# Altium schematic sheet Main.SchDoc: RFID Access Control System
size 294 x 281 mm; DrawnBy: Avishka C. Herath; Revision: 1.9; SheetNumber: 1; SheetTotal: 1; Index Number: 200212F
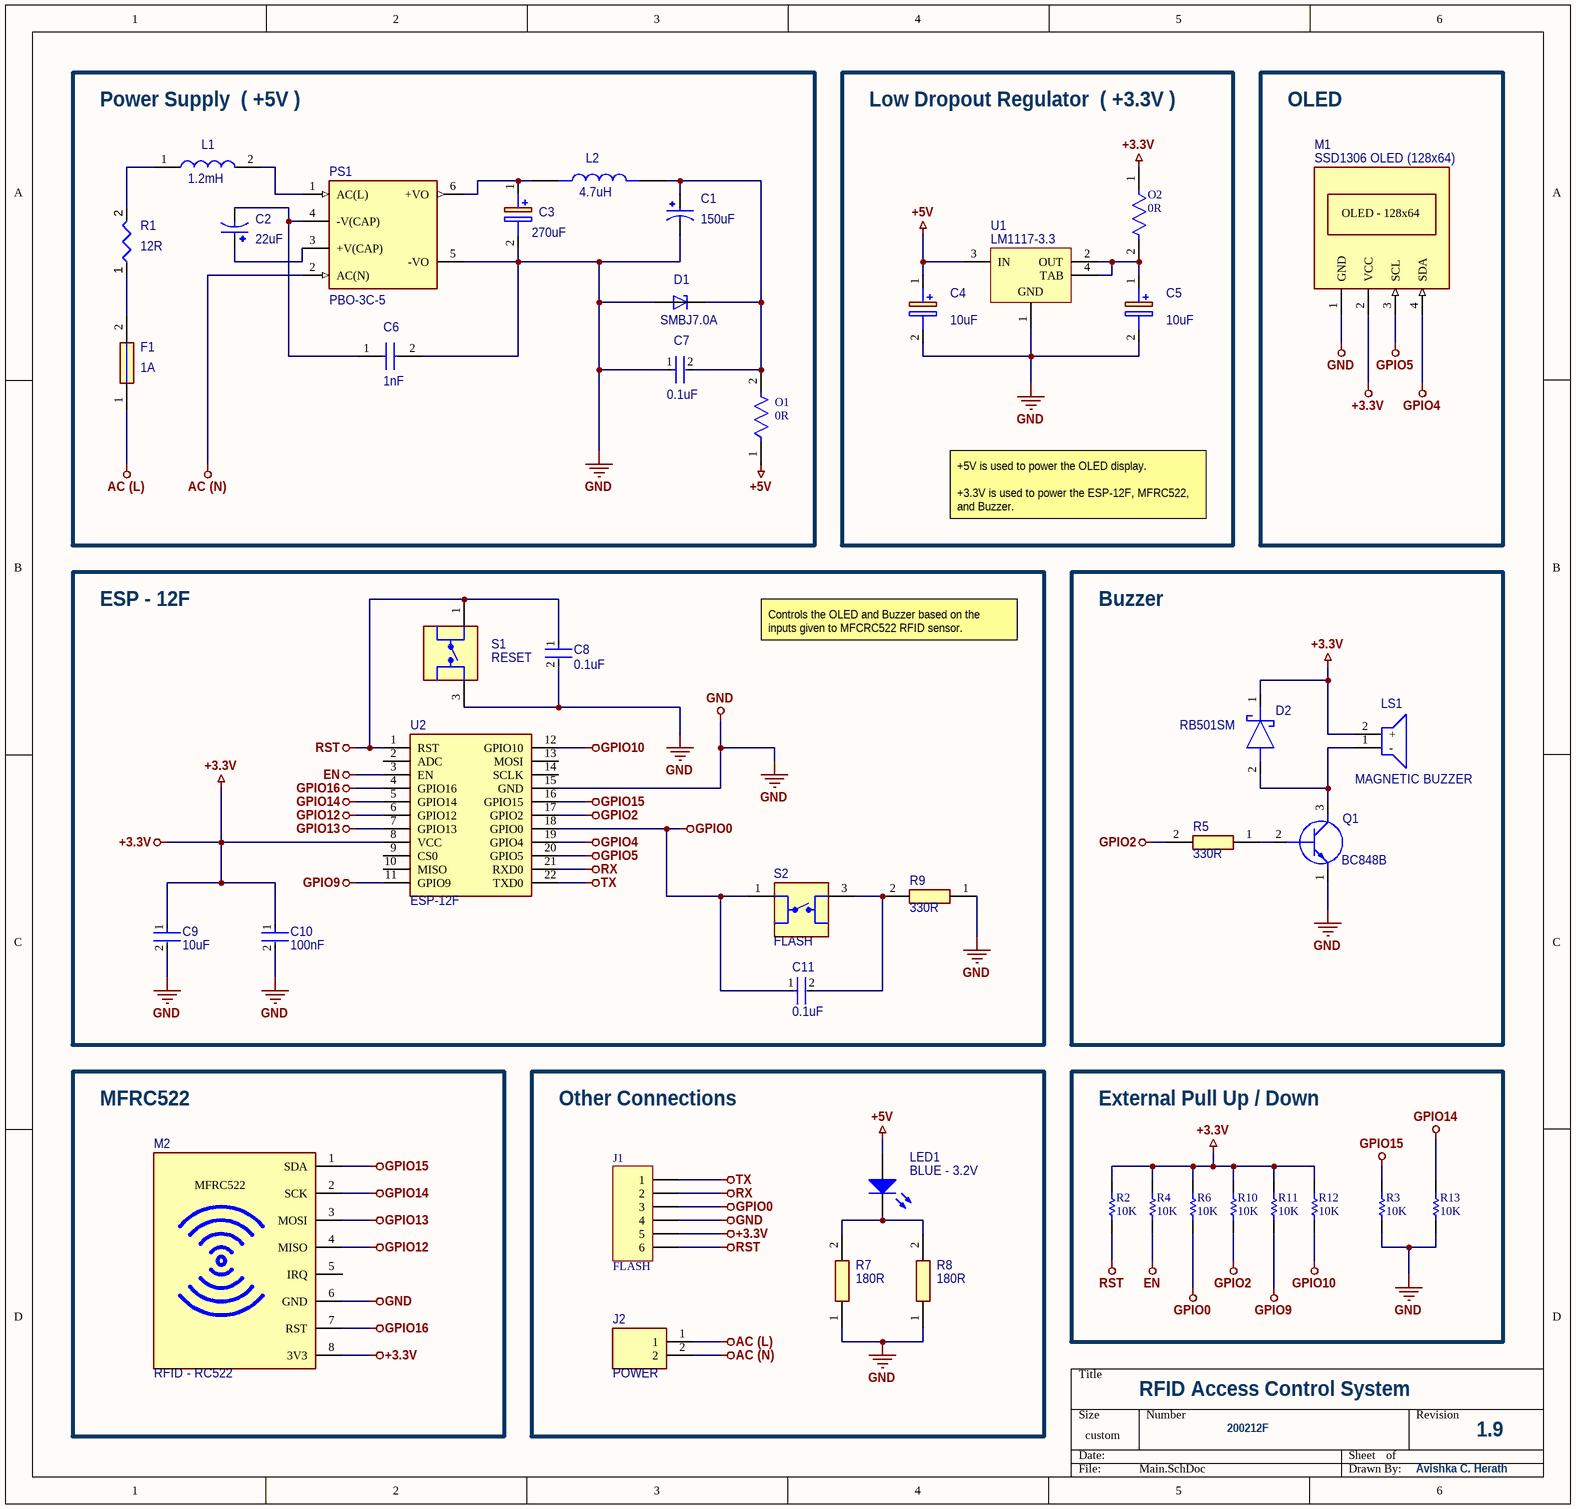
[diagram p0: Main.SchDoc]

## Parts
C1  150uF  [CAPPRD500W60D800H1150]
C2  22uF  [CAPPRD750W80D1600H2500]
C3  270uF  [CAPPRD250W65D630H900]
C4  10uF  [T491B]
C5  10uF  [T491B]
C6  1nF  [B32529C8102J]
C7  0.1uF  [FP-CL10-0_1-MFG]
C8  0.1uF  [FP-CL10-0_1-MFG]
C9  10uF  [FP-CL21-IPC_B]
C10  100nF  [FP-CL10-0_1-MFG]
C11  0.1uF  [FP-CL10-0_1-MFG]
D1  SMBJ7.0A  [DIOM4336X265N]
D2  RB501SM  [RB501SM30FHT2R]
F1  1A  [SS5H1AAPH]
J1  FLASH  [My_1X06]
J2  POWER  [TB00250002BE]
L1  1.2mH  [RLB9012122KL]
L2  4.7uH  [IND_ASPI-0615FS-4R7M-T2]
LED1  BLUE - 3.2V  [3528]
LS1  MAGNETIC BUZZER  [CMI1295IC0385T]
M1  SSD1306 OLED (128x64)  [SSD1306 OLED (128x64)-Footprint-1]
M2  RFID - RC522  [RFID - RC522-Footprint-1]
O1  0R  [FP-RC0805-MFG]
O2  0R  [FP-RC0805-MFG]
PS1  PBO-3C-5  [CONV_PBO-3C-5]
Q1  BC848B  [SOT95P240X120-3N]
R1  12R  [WA84-12RJI-Footprint-1]
R2  10K  [RESC2013X60X35ML10T20]
R3  10K  [RESC2013X60X35ML10T20]
R4  10K  [RESC2013X60X35ML10T20]
R5  330R  [RESC2012X60N]
R6  10K  [RESC2013X60X35ML10T20]
R7  180R  [RESC2012X60N]
R8  180R  [RESC2012X60N]
R9  330R  [RESC2012X60N]
R10  10K  [RESC2013X60X35ML10T20]
R11  10K  [RESC2013X60X35ML10T20]
R12  10K  [RESC2013X60X35ML10T20]
R13  10K  [RESC2013X60X35ML10T20]
S1  RESET  [SW_PTS525SM15SMTR2LFS]
S2  FLASH  [SW_PTS525SM15SMTR2LFS]
U1  LM1117-3.3  [DCY0004A_L]
U2  ESP-12F  [esp12f]

## Blocks framed on the sheet
Power Supply  ( +5V ): C1-C3 C6 C7 D1 F1 L1 L2 O1 PS1 R1
Low Dropout Regulator  ( +3.3V ): C4 C5 O2 U1
OLED: M1
ESP - 12F: C8-C11 R9 S1 S2 U2
Buzzer: D2 LS1 Q1 R5
MFRC522: M2
Other Connections: J1 J2 LED1 R7 R8
External Pull Up / Down: R2-R4 R6 R10-R13

## Nets
+3.3V: C9.1 C10.1 D2.1(K) J1.5 LS1.2(+) M1.2(VCC) M2.8(3V3) O2.1 R2.1 R4.1 R6.2 R10.2 R11.2 R12.2 U2.8(VCC)
+5V: C4.1(+) LED1.2(A) O1.1 U1.3(IN)
AC (L): F1.1 J2.1
AC (N): J2.2 PS1.2(AC(N))
EN: R4.2 U2.3(EN)
GND: C1.N C3.2(-) C4.2(-) C5.2(-) C6.2 C7.1 C8.2 C9.2 C10.2 D1.A J1.4 M1.1(GND) M2.6(GND) PS1.5(-VO) Q1.1(E) R3.2 R7.1 R8.1 R9.1 R13.2 S1.3 U1.1(GND) U2.15(GND)
GPIO0: C11.1 J1.3 R6.1 S2.1 U2.18(GPIO0)
GPIO2: R5.2 R10.1 U2.17(GPIO2)
GPIO4: M1.4(SDA) U2.19(GPIO4)
GPIO5: M1.3(SCL) U2.20(GPIO5)
GPIO9: R11.1 U2.11(GPIO9)
GPIO10: R12.1 U2.12(GPIO10)
GPIO12: M2.4(MISO) U2.6(GPIO12)
GPIO13: M2.3(MOSI) U2.7(GPIO13)
GPIO14: M2.2(SCK) R13.1 U2.5(GPIO14)
GPIO15: M2.1(SDA) R3.1 U2.16(GPIO15)
GPIO16: M2.7(RST) U2.4(GPIO16)
RST: C8.1 J1.6 R2.2 S1.1 U2.1(RST)
RX: J1.2 U2.21(RXD0)
TX: J1.1 U2.22(TXD0)
NetC1_P: C1.P C7.2 D1.C L2.2 O1.2
NetC2_N: C2.N C6.1 PS1.4(-V(CAP))
NetC2_P: C2.P PS1.3(+V(CAP))
NetC3_1: C3.1(+) L2.1 PS1.6(+VO)
NetC5_1: C5.1(+) O2.2 U1.2(OUT) U1.4(TAB)
NetC11_2: C11.2 R9.2 S2.3
NetD2_2: D2.2(A) LS1.1(-) Q1.3(C)
NetF1_2: F1.2 R1.1
NetL1_1: L1.1 R1.2
NetL1_2: L1.2 PS1.1(AC(L))
NetLED1_1: LED1.1(K) R7.2 R8.2
NetQ1_2: Q1.2(B) R5.1

Not connected (* = marked no-connect by the designer): M2 5(IRQ); PS1 4_2(-V(CAP)) 5_2(-VO); S1 2 4; S2 2 4; U2 2(ADC) 9(CS0) 10(MISO) 13(MOSI) 14(SCLK)

## Notes on the sheet
- +5V is used to power the OLED display.
  +3.3V is used to power the ESP-12F, MFRC522, and Buzzer.
- Controls the OLED and Buzzer based on the inputs given to MFCRC522 RFID sensor.
- (in symbol CMP-00026-00001-2) OLED - 128x64

## Library data of the parts
C1 = EEUFR1V221B: FR-A; MF: {'manufacturer': u'Panasonic'}; MP: UHE1V151MPD1TD; Value: *; Price: None; Availability: Unavailable; Package: None
C2 = EEUTP1E272B: Aluminum Electrolytic Capacitors - Radial Leaded; MF: Nichicon; MP: UVR2W220MHD; Value: 22uF; Price: None; Availability: Unavailable; Package: Bulk; ComponentLink1Description: Mouser; ComponentLink1URL: https://www.mouser.com/ProductDetail/Nichicon/UVR2W220MHD?qs=%252BlpsHQzXjw%2F%252B5drQqN1W8w%3D%3D; Supplier 1: Rs; Supplier Part Number 1: 5201365
C3 = 6SEPC560MW+TSS: Aluminum Organic Polymer Capacitors; Manufacturer_Name: KEMET; Manufacturer_Part_Number: A750EM277M1CAAE015; Datasheet Link: http://industrial.panasonic.com/cdbs/www-data/pdf/AAB8000/AAB8000C247.pdf; Height: 9mm; Mouser Part Number: 667-6SEPC560MW+TSS; Mouser Price/Stock: https://www.mouser.co.uk/ProductDetail/Panasonic/6SEPC560MW%2bTSS?qs=OE1iw1LrrPGkg%2Fufb0Bk8Q%3D%3D; Arrow Part Number: 6SEPC560MW+TSS; Arrow Price/Stock: https://www.arrow.com/en/products/6sepc560mwtss/panasonic?region=nac
C4 C5 = T491B106M010AT: Capacitor Polarised; Manufacturer_Name: KEMET; Datasheet Link: https://content.kemet.com/datasheets/KEM_T2005_T491.pdf; Height: 2.1mm; Manufacturer_Part_Number: T491B106M010AT; Mouser Part Number: 80-T491B106M010; Arrow Part Number: T491B106M010AT; Arrow Price/Stock: https://www.arrow.com/en/products/t491b106m010at/kemet-corporation?region=nac
C6 = B32529C8102J: Capacitor; Manufacturer_Name: TDK; Datasheet Link: https://componentsearchengine.com/Datasheets/1/B32529C8102J.pdf; Height: 6.5mm; Manufacturer_Part_Number: B32529C8102J; Mouser Part Number: 871-B32529C8102J; Mouser Price/Stock: https://www.mouser.co.uk/ProductDetail/EPCOS-TDK/B32529C8102J?qs=CveI%2FUwZDBKgVtfngCVMDw%3D%3D
C7 C8 C11 = CMP-13271-000011-1: CAP CER 0.1UF 50V X7R 0603; Manufacturer: Samsung Electro-Mechanics America, Inc; Manufacturer Part Number: CL10B104JB8NNNC; Value: 100nF; Material: Ceramic; Temperature Coefficient: 15%; Tolerance: 5%; Ipc Land Pattern Name: CAPC16080X80; Device Class L1: Passive Components; Digikey Description: CAP CER 0.1UF 50V X7R 0603; Voltage Rating: 50V; Height: 0.9mm; ComponentLink2Description: Datasheet; Device Class L2: Capacitors; ComponentLink2URL: http://www.samsungsem.com/kr/support/product-search/mlcc/__icsFiles/afieldfile/2019/06/18/CL10B104JB8NNNC-19.pdf; Temperature Characteristic: X7R; Temperature Range High: +125°C; Lead Free: Yes; Temperature Range Low: -55°C; Category: Cap; Package: CL10-0.1; Temperature: -55°C to +125°C; Octopart: https://octopart.com/cl10b104jb8nnnc-samsung-9302151; Device Class L3: Ceramic Capacitors; RoHS: TRUE; Automotive: No; Capacitance: 100nF
C9 = CMP-2000-06102-2: CL21 Series 0805 10uF 16V ±10% Tolerance X5R Multilayer Ceramic Chip Capacitor; Dielectric: X7R; Length: 2mm; Depth: 1.25mm; Voltage: 16V; Width: 0.049inch; Capacitance: 10uF; Lead Free: Lead Free; Max Operating Temperature: 85°C; Mount: Surface Mount; Voltage Rating: 16V; Height: 1.25mm; Radiation Hardening: No; Packaging: Tape and Reel; Voltage Rating (DC): 16V; Thickness: 0.055inch; Case/Package: 0805; Case Code (Imperial): 0805; Min Operating Temperature: -55°C; Case Code (Metric): 2012; Package Quantity: 1; Tolerance: 10%
C10 = CMP-13271-000011-1: CAP CER 0.1UF 50V X7R 0603; Manufacturer: Samsung Electro-Mechanics America, Inc; Manufacturer Part Number: CL10B104JB8NNNC; Material: Ceramic; Temperature Coefficient: 15%; Tolerance: 5%; Ipc Land Pattern Name: CAPC16080X80; Device Class L1: Passive Components; Digikey Description: CAP CER 0.1UF 50V X7R 0603; Voltage Rating: 50V; Height: 0.9mm; ComponentLink2Description: Datasheet; Device Class L2: Capacitors; ComponentLink2URL: http://www.samsungsem.com/kr/support/product-search/mlcc/__icsFiles/afieldfile/2019/06/18/CL10B104JB8NNNC-19.pdf; Temperature Characteristic: X7R; Value: 100nF; Temperature Range High: +125°C; Lead Free: Yes; Temperature Range Low: -55°C; Category: Cap; Package: CL10-0.1; Temperature: -55°C to +125°C; Octopart: https://octopart.com/cl10b104jb8nnnc-samsung-9302151; Device Class L3: Ceramic Capacitors; RoHS: TRUE; Automotive: No; Capacitance: 100nF
D1 = SMBJ7.0A: MF: {'manufacturer': u'Littelfuse'}; Value: *; Price: None; Availability: Unavailable; Package: None; MP: SMBJ7.0A
D2 = RB501SM-30FHT2R: Schottky Diode; Manufacturer_Name: ROHM Semiconductor; Datasheet Link: https://fscdn.rohm.com/en/products/databook/datasheet/discrete/diode/schottky_barrier/rb501sm-30fht2r-e.pdf; Height: 0.6mm; Manufacturer_Part_Number: RB501SM-30FHT2R; Mouser Part Number: 755-RB501SM-30FHT2R; Mouser Price/Stock: https://www.mouser.co.uk/ProductDetail/ROHM-Semiconductor/RB501SM-30FHT2R?qs=4v%252BiZTmLVHEIefGC27iswg%3D%3D
F1 = CMP-018-000000-1: Fuse; Manufacturer_Name: Eaton; Datasheet Link: https://www.eaton.com/content/dam/eaton/products/electronic-components/resources/data-sheet/eaton-ss-5h-subminiature-radial-leaded-time-delay-fuses-data-sheet.pdf; Height: 8.55mm; Arrow Price/Stock: https://www.arrow.com/en/products/ss-5h-1a-aph/eaton?region=nac; Pin Count: 2; Source: SamacSys.SchLib; Design Item ID: SS-5H-1A-APH; Mouser Part Number: 504-SS-5H-1A-APH; Manufacturer_Part_Number: SS-5H-1A-APH; Arrow Part Number: SS-5H-1A-APH; Component Type: Standard; Mouser Price/Stock: https://www.mouser.co.uk/ProductDetail/Bussmann-Eaton/SS-5H-1A-APH?qs=uEhifBLpbD3ldHjMqFUUYA%3D%3D
J1 = Header 6: Header, 6-Pin; ASiD Part Number: Header 6-AS
J2 = TB002-500-02BE: Connector; Manufacturer_Name: CUI Devices; Datasheet Link: https://eu.mouser.com/datasheet/2/670/tb002_500-1550579.pdf; Height: 10.4mm; Manufacturer_Part_Number: TB002-500-02BE; Mouser Part Number: 490-TB002-500-02BE; Mouser Price/Stock: https://www.mouser.co.uk/ProductDetail/CUI-Devices/TB002-500-02BE?qs=vLWxofP3U2x9716kcgva%2Fw%3D%3D; Arrow Part Number: TB002-500-02BE; Arrow Price/Stock: https://www.arrow.com/en/products/tb002-500-02be/cui-devices?region=nac
L1 = RLB9012-122KL: Inductor; Manufacturer_Name: Bourns; Datasheet Link: https://datasheet.datasheetarchive.com/originals/dk/DKDS-12/225018.pdf; Height: 12.2mm; Manufacturer_Part_Number: RLB9012-122KL; Mouser Part Number: 652-RLB9012-122KL; Mouser Price/Stock: https://www.mouser.co.uk/ProductDetail/Bourns/RLB9012-122KL?qs=dB0LedT%252BmmC%2Fvhpfl8NA4g%3D%3D; Arrow Part Number: RLB9012-122KL; Arrow Price/Stock: https://www.arrow.com/en/products/rlb9012-122kl/bourns?region=nac
L2 = ASPI-0615FS-4R7M-T2: MF: {'manufacturer': u'Abracon'}; Value: *; Price: None; Availability: Unavailable; Package: None; MP: ASPI-0615FS-4R7M-T2
LED1 = CMP-1429-00005-1: SMD mono-color Top LED, WL-SMTW, Blue; PartNumber: 150141BS73100; Manufacturer: Wuerth Elektronik; ComponentLink2Description: Datasheet; ComponentLink1Description: Manufacturer URL; ComponentLink2URL: http://katalog.we-online.com/led/datasheet/150141BS73100.pdf; ComponentLink1URL: http://www.we-online.com; PackageReference: 3528; Color: Blue
LS1 = CMI-1295IC-0385T: Loudspeaker or Buzzer; Manufacturer_Name: CUI Devices; Datasheet Link: https://www.arrow.com/en/products/cmi-1295ic-0385t/cui-devices; Height: 9.7mm; Manufacturer_Part_Number: CMI-1295IC-0385T; Mouser Part Number: 490-CMI-1295IC-0385T; Mouser Price/Stock: https://www.mouser.co.uk/ProductDetail/CUI-Devices/CMI-1295IC-0385T?qs=OlC7AqGiEDk2g42uzfEhlg%3D%3D; Arrow Part Number: CMI-1295IC-0385T; Arrow Price/Stock: https://www.arrow.com/en/products/cmi-1295ic-0385t/cui-devices?region=nac
M1 = CMP-00026-00001-2: The OLED display module is a small 0.96" diagonal display made of individual blue OLED pixels that can be turned on or off by the controller chip. It does not require a backlight and is compatible with I2C communication through the SSD1306 driver chip.; Number of Pixels: 128 × 64; Size: 0.96"; Interface: I2C; Dimension: 27.8 x27.3x 4.3 mm
M2 = CMP-00025-00003-1: A 13.56MHz RF reader module, which use the RC522 IC, plus 2 S50 RFID cards to help you learn and add the 13.56 MHz RF transition to your project.; IC: MFRC522; Interface: I2C,SPI,UART; Operating Frequency: 13.56 MHz; Dimensions: 40mm×60mm
O1 O2 = CMP-2001-04570-2: RES SMD 0 OHM JUMPER 1/8W 0805; Manufacturer: Yageo; Manufacturer Part Number: RC0805FR-070RL; Resistance: 0Ω; Value: 0Ω; Power Rating: 0.125W; Tolerance: 1%; Voltage Rating: 150V; RoHS: TRUE; Device Class L2: Resistors; Composition: Thick Film; Device Class L1: Passive Components; Height: 0.6mm; Category: Res; Automotive: No; Device Class L3: Chip SMD Resistors; ComponentLink2URL: http://www.yageo.com/documents/recent/PYu-RC_Group_51_RoHS_L_10.pdf; Octopart: https://octopart.com/rc0805fr-070rl-yageo-9293404; Temperature Range High: +155°C; Ipc Land Pattern Name: RESC200125X50; Footprint Url: http://www.yageo.com/exep/pages/download/literatures/PYu-R_Mount_10.pdf; Series: RC_L; Digikey Description: RES SMD 0 OHM JUMPER 1/8W 0805; Temperature Range Low: -55°C; Temperature: -55°C to +155°C; Package: RC0805; ComponentLink2Description: Datasheet; Lead Free: Yes
PS1 = PBO-3C-5: MF: {'manufacturer': u'CUI'}; Value: *; Price: None; Availability: Unavailable; Package: None; MP: PBO-3C-5
Q1 = BC848BHZGT116: Transistor BJT NPN; Manufacturer_Name: ROHM Semiconductor; Datasheet Link: https://componentsearchengine.com/Datasheets/2/BC848BHZGT116.pdf; Height: 1.2mm; Manufacturer_Part_Number: BC848BHZGT116; Mouser Part Number: 755-BC848BHZGT116; Mouser Price/Stock: https://www.mouser.co.uk/ProductDetail/ROHM-Semiconductor/BC848BHZGT116?qs=zGux8KhMp6JnZZvroKxywg%3D%3D
R1 = CMP-009-00177-4: Through Hole Wirewound Resistor, Wa80 Series, 12 Ohm, 3 W, - 5%, 100 V, Axial Leaded Rohs Compliant: Yes; Body Length: 14.5mm; Lead Length: 24.55mm; Lead Diameter: 0.8mm; Body Diameter: 5.2mm; Case/Package: Axial
R2-R4 R6 R10-R13 = CMP-009-00179-1: Res Thick Film 0805 10K Ohm 1% 0.125W(1/8W) +/-100ppm/C Epoxy Pad SMD T/R
R5 R9 = RC0805FR-07330RL: Resistor; Manufacturer_Name: KEMET; Datasheet Link: http://www.yageo.com/documents/recent/PYu-RC_Group_51_RoHS_L_10.pdf; Height: 0.6mm; Manufacturer_Part_Number: RC0805FR-07330RL; Mouser Part Number: 603-RC0805FR-07330RL; Mouser Price/Stock: https://www.mouser.com/Search/Refine.aspx?Keyword=603-RC0805FR-07330RL
R7 R8 = RC0805FR-07180RL: Resistor; Manufacturer_Name: KEMET; Datasheet Link: http://www.yageo.com/documents/recent/PYu-RC_Group_51_RoHS_L_10.pdf; Height: 0.6mm; Manufacturer_Part_Number: RC0805FR-07180RL; Mouser Part Number: 603-RC0805FR-07180RL; Mouser Price/Stock: https://www.mouser.co.uk/ProductDetail/Yageo/RC0805FR-07180RL/?qs=fRxXYNj8ftG7jMu9i6mDhQ%3D%3D; Arrow Part Number: RC0805FR-07180RL; Arrow Price/Stock: https://www.arrow.com/en/products/rc0805fr-07180rl/yageo
S1 S2 = CMP-035-000000-1: Tactile Switch SPST-NO Top Actuated Surface Mount; MP: PTS525SM15SMTR2 LFS; MF: C&K; Purchase-URL: https://pricing.snapeda.com/search/part/PTS525SM15SMTR2 LFS/?ref=eda; Value: *; Component Type: Standard; Check_prices: https://www.snapeda.com/parts/PTS525SM15SMTR2%20LFS/C%2526K/view-part/?ref=eda; SnapEDA_Link: https://www.snapeda.com/parts/PTS525SM15SMTR2%20LFS/C%2526K/view-part/?ref=snap; Design Item ID: PTS525SM15SMTR2LFS; Pin Count: 4; Source: PTS525SM15SMTR2LFS.SchLib; Price: None; Availability: In Stock; Package: Tactile Switch CK
U1 = CMP-0062-01639-4: 800mA Low-Dropout Linear Regulator, 4-pin SOT-223, Pb-Free; PartNumber: LM1117MPX-3.3/NOPB; Manufacturer: Texas Instruments; High-Reliability: Y; PowerWise: N; PackageTopMarking: XYTT*N05A; CompType: LDO IC; ComponentLink1URL: http://www.ti.com/general/docs/lit/getliterature.tsp?genericPartNumber=LM1117-N&fileType=pdf; ComponentLink1Description: Datasheet URL; PinCount: 4; Code_JEDEC: TO-261-AA; PackageDescription: Molded SOT-223, 6.50 x 3.56 x 1.6mm Body, 4 Lead, 2.3mm Pitch; PackageReference: DCY0004A; RoHS: Y; Code_IPC: SOT223-4
U2 = ESP-12F: Integrated Circuit; Manufacturer_Name: Ai-Thinker; Datasheet Link: https://docs.ai-thinker.com/_media/esp8266/docs/esp-12f_product_specification_en.pdf; Height: 3.1mm; Manufacturer_Part_Number: ESP-12F